# EAGLE design ESP32_breakout v2.1 (EAGLE 7.7.0)
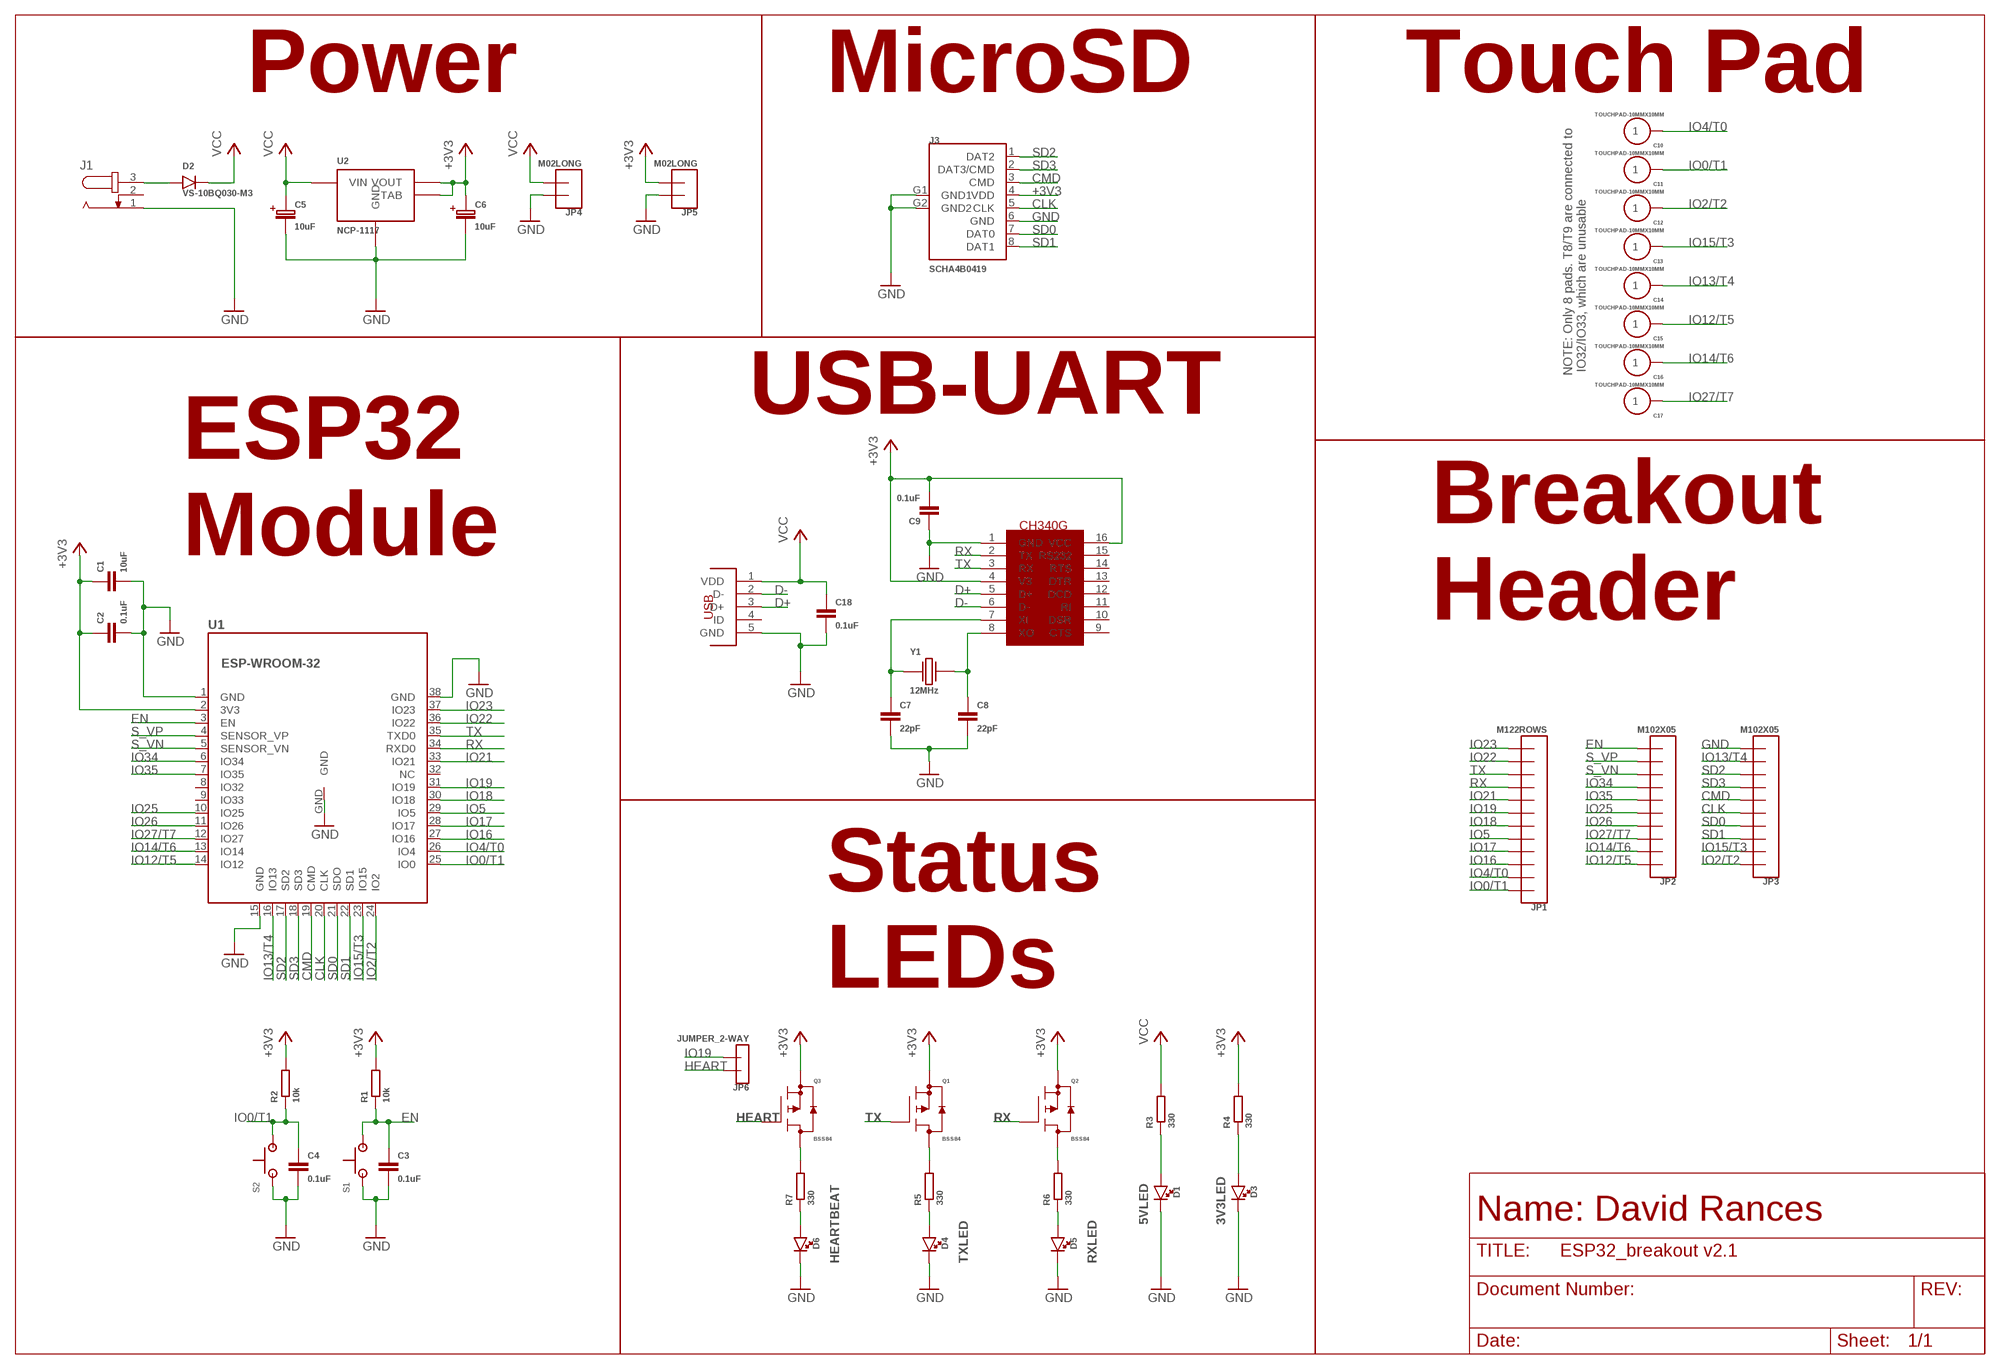
[diagram p0: schematic, sheet 1]

## Parts
C1  10uF  CAP0603  [CAP-0603]
C2  0.1uF  CAP0603  [CAP-0603]
C3  0.1uF  CAP0603  [CAP-0603]
C4  0.1uF  CAP0603  [CAP-0603]
C5  10uF  CAP-POLARCASEB-3528  [B-3528]
C6  10uF  CAP-POLARCASEB-3528  [B-3528]
C7  22pF  CAP0603  [CAP-0603]
C8  22pF  CAP0603  [CAP-0603]
C9  0.1uF  CAP0603  [CAP-0603]
C10  TOUCHPAD-10MMX10MM  [TOUCH-10MMX10MM]
C11  TOUCHPAD-10MMX10MM  [TOUCH-10MMX10MM]
C12  TOUCHPAD-10MMX10MM  [TOUCH-10MMX10MM]
C13  TOUCHPAD-10MMX10MM  [TOUCH-10MMX10MM]
C14  TOUCHPAD-10MMX10MM  [TOUCH-10MMX10MM]
C15  TOUCHPAD-10MMX10MM  [TOUCH-10MMX10MM]
C16  TOUCHPAD-10MMX10MM  [TOUCH-10MMX10MM]
C17  TOUCHPAD-10MMX10MM  [TOUCH-10MMX10MM]
C18  0.1uF  CAP0603  [CAP-0603]
D1  LED1206  [LED-1206]
D2  VS-10BQ030-M3  [DO-214AA]
D3  LED1206  [LED-1206]
D4  LED1206  [LED-1206]
D5  LED1206  [LED-1206]
D6  LED1206  [LED-1206]
J1  JACK-PLUG0  [SPC4077]
J3  SCHA4B0419  [MICROSD_SCHA4B0419]
JP1  M122ROWS  [2X06]
JP2  M102X05  [2X05]
JP3  M102X05  [2X05]
JP4  M02LONG  [1X02-LONG]
JP5  M02LONG  [1X02-LONG]
JP6  JUMPER_2-WAY  [1X02]
Q1  BSS84  [SOT-23-3]
Q2  BSS84  [SOT-23-3]
Q3  BSS84  [SOT-23-3]
R1  10k  RESISTOR0603  [RES-0603]
R2  10k  RESISTOR0603  [RES-0603]
R3  330  RESISTOR0805  [RES-0805]
R4  330  RESISTOR0805  [RES-0805]
R5  330  RESISTOR0805  [RES-0805]
R6  330  RESISTOR0805  [RES-0805]
R7  330  RESISTOR0805  [RES-0805]
S1  PUSHBUTTONSKHMQME010  [SKHMQME010]
S2  PUSHBUTTONSKHMQME010  [SKHMQME010]
U1  ESP-WROOM-32  [ESP-WROOM-32]
U2  NCP-1117  [SOT-223-4]
U$4  MOLEX_USBMICRO  [MOLEX_47346-001]
U$7  CH340G  [SOIC16]
Y1  12MHz  ABLS-12MHZ-B2-T  [HC-49/US]

## Nets
+3V3: C1.1 C2.1 C6.P C9.2 J3.4(VDD) JP5.2 Q1.S Q2.S Q3.S R1.2 R2.2 R4.2 U1.2(3V3) U2.2(VOUT) U2.PAD(TAB) U$7.4(V3) U$7.16(VCC)
CLK: J3.5(CLK) JP3.5 U1.20(CLK)
CMD: J3.3(CMD) JP3.6 U1.19(CMD)
D+: U$4.3(D+) U$7.5(D+)
D-: U$4.2(D-) U$7.6(D-)
EN: C3.1 JP2.10 R1.1 S1.3 S1.4 U1.3(EN)
GND: C1.2 C2.2 C3.2 C4.2 C5.N C6.N C7.2 C8.2 C9.1 C18.2 D1.C D3.C D4.C D5.C D6.C J1.1 J3.6(GND) J3.G1(GND1) J3.G2(GND2) JP3.10 JP4.1 JP5.1 S1.1 S1.2 S2.1 S2.2 U1.1(GND) U1.15(GND) U1.38(GND) U1.GND U2.1(GND) U$4.5(GND) U$7.1(GND)
HEART: JP6.1 Q3.G
IO0/T1: C4.1 C11.P$1 JP1.1 R2.1 S2.3 S2.4 U1.25(IO0)
IO2/T2: C12.P$1 JP3.1 U1.24(IO2)
IO4/T0: C10.P$1 JP1.2 U1.26(IO4)
IO5: JP1.5 U1.29(IO5)
IO12/T5: C15.P$1 JP2.1 U1.14(IO12)
IO13/T4: C14.P$1 JP3.9 U1.16(IO13)
IO14/T6: C16.P$1 JP2.2 U1.13(IO14)
IO15/T3: C13.P$1 JP3.2 U1.23(IO15)
IO16: JP1.3 U1.27(IO16)
IO17: JP1.4 U1.28(IO17)
IO18: JP1.6 U1.30(IO18)
IO19: JP1.7 JP6.2 U1.31(IO19)
IO21: JP1.8 U1.33(IO21)
IO22: JP1.11 U1.36(IO22)
IO23: JP1.12 U1.37(IO23)
IO25: JP2.5 U1.10(IO25)
IO26: JP2.4 U1.11(IO26)
IO27/T7: C17.P$1 JP2.3 U1.12(IO27)
IO34: JP2.7 U1.6(IO34)
IO35: JP2.6 U1.7(IO35)
N$1: D1.A R3.1
N$2: D2.A J1.3
N$3: C7.1 U$7.7(XI) Y1.P$1
N$4: C8.1 U$7.8(XO) Y1.P$2
N$5: D3.A R4.1
N$6: Q1.D R5.2
N$7: Q2.D R6.2
N$8: D4.A R5.1
N$9: D6.A R7.1
N$10: Q3.D R7.2
N$11: D5.A R6.1
RX: JP1.9 Q2.G U1.34(RXD0) U$7.2(TX)
S_VN: JP2.8 U1.5(SENSOR_VN)
S_VP: JP2.9 U1.4(SENSOR_VP)
SD0: J3.7(DAT0) JP3.4 U1.21(SDO)
SD1: J3.8(DAT1) JP3.3 U1.22(SD1)
SD2: J3.1(DAT2) JP3.8 U1.17(SD2)
SD3: J3.2(DAT3/CMD) JP3.7 U1.18(SD3)
TX: JP1.10 Q1.G U1.35(TXD0) U$7.3(RX)
VCC: C5.P C18.1 D2.C JP4.2 R3.2 U2.3(VIN) U$4.1(VDD)
Unconnected: J1.2 S1.5 S2.5 U1.8(IO32) U1.9(IO33) U1.32(NC) U$4.4(ID) U$7.9(CTS) U$7.10(DSR) U$7.11(RI) U$7.12(DCD) U$7.13(DTR) U$7.14(RTS) U$7.15(RS232)

## Notes on the sheet
- Power | MicroSD | Touch Pad
- NOTE: Only 8 pads. T8/T9 are connected to
   IO32/IO33, which are unusable
- USB-UART
- ESP32
  Module
- Breakout
  Header
- Status
  LEDs
- Name: David Rances
- 5VLED | 3V3LED
- HEARTBEAT | TXLED | RXLED

## Library data of the parts
C1-C4 C7-C9 C18 = dr-library:CAP: Multilayer Ceramic Capacitor
C5 C6 = dr-library:CAP-POLAR
C10-C17 = dr-library:TOUCHPAD
D1 D3-D6 = dr-library:LED
D2 = dr-library:VS-10BQ030-M3: Vishay Semiconductors High Performance Schottky Rectifier 1.0A Mfg. No. VS-10BQ030-M3/5BT http://www.mouser.com/ds/2/427/vs-10bq030-m3-552919.pdf
J1 = EmbeddedAdventures 3:JACK-PLUG: DC POWER JACK Power Jack, DC, Right Angle, Through Hole, Rated 5A at 16VDC, PC Terminals Distributor: Farnell (www.Farnell.de) Drawing: 84N1161.pdf / 84N1162.pdf Manufacturer: SPC Technology (www.spctechnology.com) Type: SPC4077 / SPC 4078
J3 = dr-library:SCHA4B0419: ALPS MicroSD Connector Manufacturer No. SCHA4B0419 http://www2.mouser.com/ProductDetail/ALPS/SCHA4B0419/?qs=sGAEpiMZZMuJakaoiLiBpsFSICW6cUCj0ci6XSEAGXcTwv1T7afZMw%3d%3d
JP1 = dr-library:M12
JP2 JP3 = dr-library:M10
JP4 JP5 = dr-library:M02
JP6 = dr-library:JUMPER_2-WAY
Q1-Q3 = dr-library:BSS84: Fairchild Semiconductor P-Channel Enhancement Mode MOSFET Mfg. No. BSS84 Mouser No. 512-BSS84 http://www.mouser.com/ds/2/149/BSS84-1006729.pdf
R1-R7 = dr-library:RESISTOR
S1 S2 = dr-library:PUSHBUTTON: ALPS Tactile Switch 50mA at 12V Mouser Product # 688-SKHMQME010
U1 = dr-library:ESP-WROOM-32
U2 = dr-library:NCP-1117: ON Semiconductor Low Dropout Positive Voltage Regulator 1A output Datasheet: http://www.mouser.com/ds/2/308/NCP1117LP-D-82673.pdf
U$4 = dr-library:MOLEX_USBMICRO
U$7 = usb-serial:CH340G
Y1 = dr-library:ABLS-12MHZ-B2-T: Abracon 12MHz Crystal 20ppm 18pF Load Cap Manufacturer Part No. - ABLS-12.000MHZ-B2-T

## Board
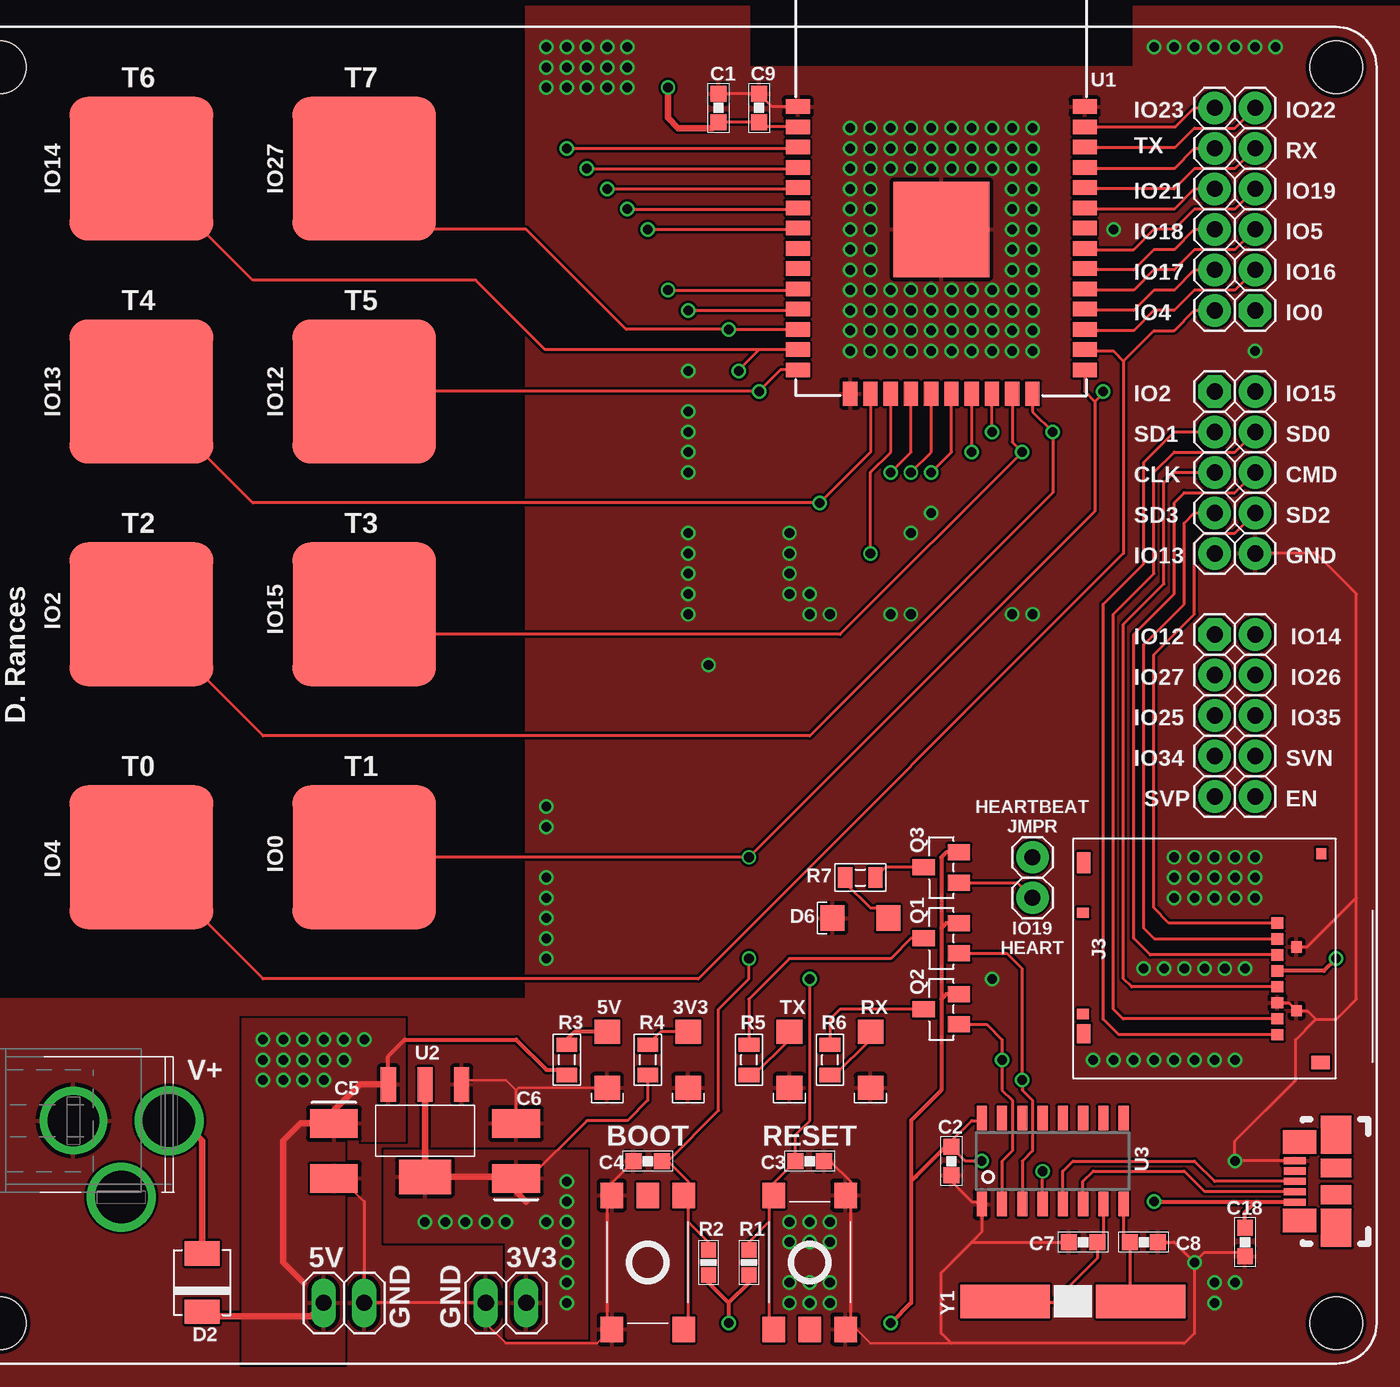
[diagram p1: board, top side]
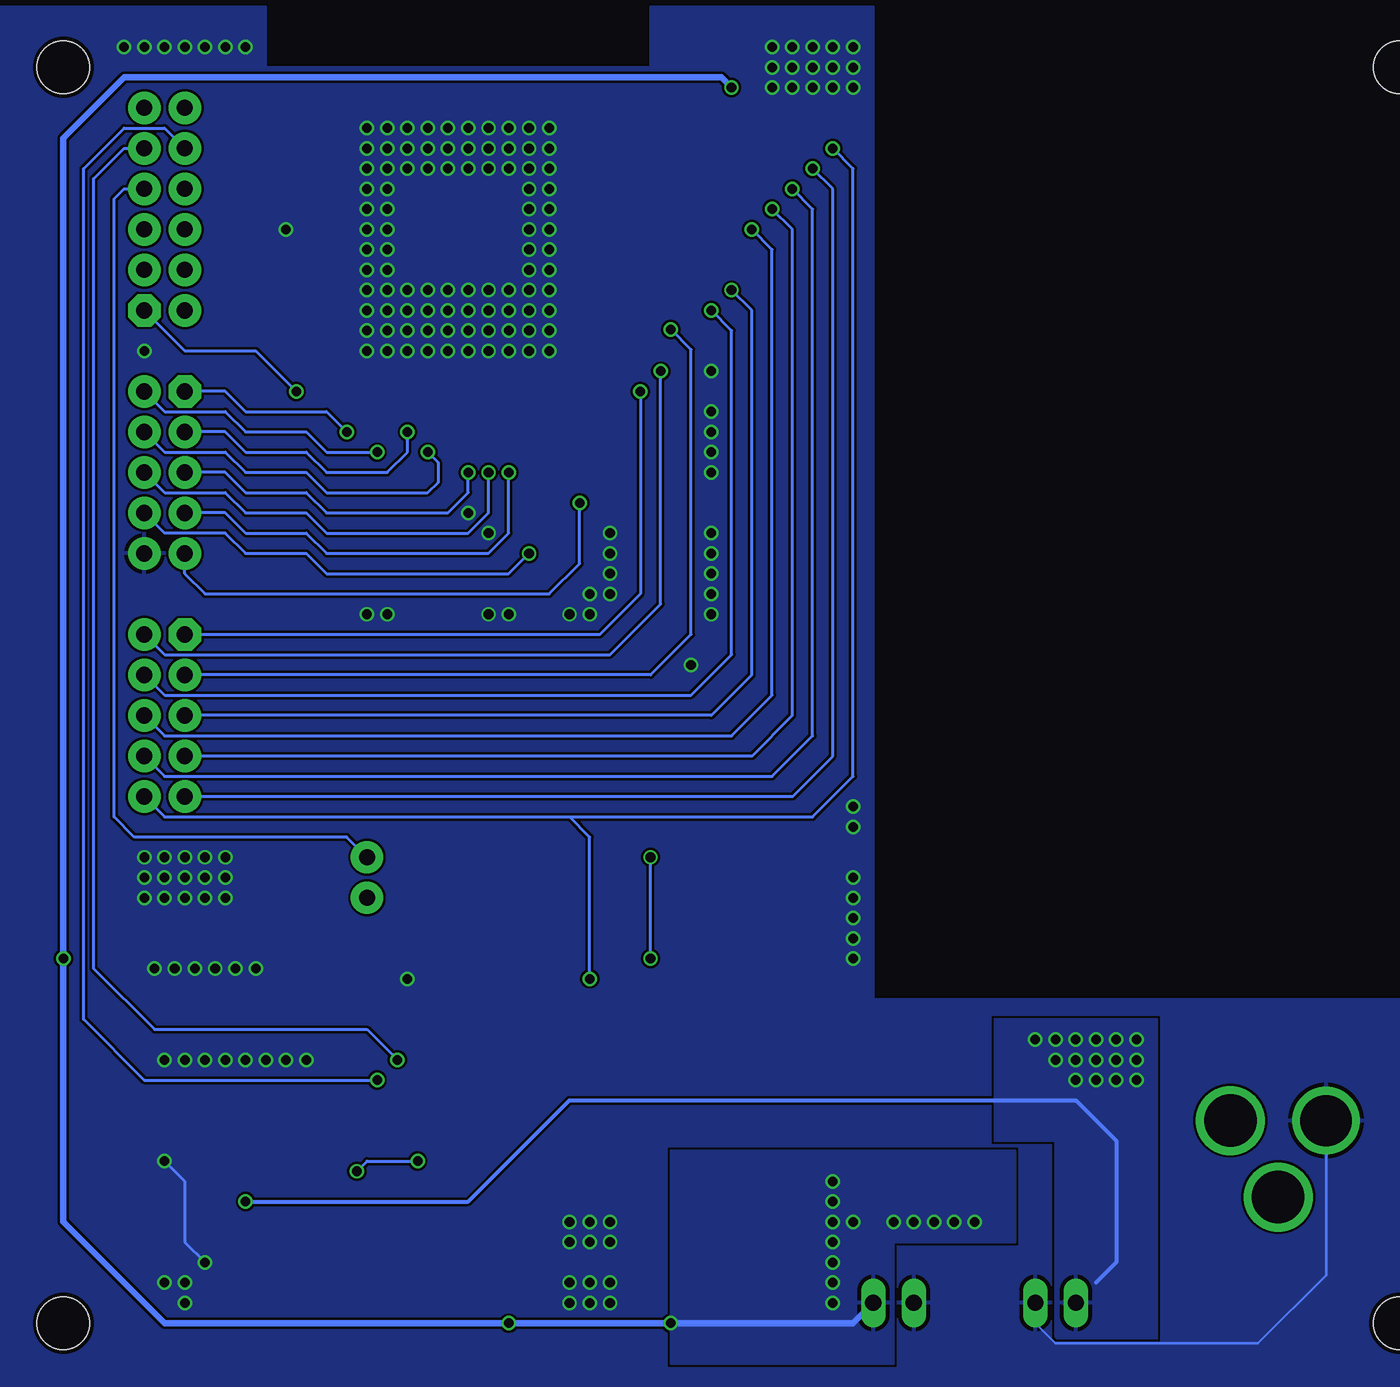
[diagram p2: board, bottom side, seen from below]

No outline drawn. Coordinates in mm, seen from the top.
Copper layers (1*16): Top 0.035mm / dielectric 1.5mm / Bottom 0.035mm
Design rules "SeeedStudio_2layer_DRU_no_angle_20140221": minimum track width 6mil, minimum drill 12mil, track to track 6mil, track to pad 6mil, pad to pad 6mil, via to via 6mil, smd to smd 0mil, copper to edge 10mil, drill to drill 10mil, minimum pad ring 10mil, minimum via ring 6mil, stop-mask expansion 2mil, vias tented up to drill 100mil, thermal gap 10mil

### Footprints (pad centres in the part's own frame; a part is rotated, then mirrored left to right if it is on the bottom)
CAP-0603 = smd 1 x 1: 1 -0.889,0; 2 0.889,0
B-3528 = smd 1.8 x 3: N 1.725,0; P -1.725,0
TOUCH-10MMX10MM = smd 9 x 9: P$1 0,0
LED-1206 = smd 1.5 x 1.6: A -1.75,0; C 1.75,0
DO-214AA = smd 1.52 x 2.18: A 1.83,0; C -1.83,0
SPC4077 = drill 3.2: 1 -3,0 | drill 3.3: 2 0,-4.8; 3 3,0
MICROSD_SCHA4B0419 = smd 0.7 x 0.75: 1 2.225,-12.825; 2 1.225,-12.825; 3 0.225,-12.825; 4 -0.775,-12.825; 5 -1.775,-12.825; 6 -2.775,-12.825; 7 -3.775,-12.825; 8 -4.775,-12.825 | smd 0.7 x 0.65: G1 -3.275,-14.025; G2 0.725,-14.025; P$1 6.575,-15.575 | smd 0.855 x 1.15: P$2 -6.515,-15.525 | smd 1.2 x 0.85: P$3 -4.713,-0.675 | smd 0.65 x 0.75: P$4 -3.475,-0.625; P$5 2.875,-0.625 | smd 1.3 x 0.85: P$6 6.013,-0.675
2X06 = drill 1.016 pad 2.032 octagon: 1 -1.27,-2.54 | drill 1.016 pad 2.032: 2 -1.27,0; 3 1.27,-2.54; 4 1.27,0; 5 3.81,-2.54; 6 3.81,0; 7 6.35,-2.54; 8 6.35,0; 9 8.89,-2.54; 10 8.89,0; 11 11.43,-2.54; 12 11.43,0
2X05 = drill 1.016 pad 2.032 octagon: 1 -1.27,-2.54 | drill 1.016 pad 2.032: 2 -1.27,0; 3 1.27,-2.54; 4 1.27,0; 5 3.81,-2.54; 6 3.81,0; 7 6.35,-2.54; 8 6.35,0; 9 8.89,-2.54; 10 8.89,0
1X02-LONG = drill 1.016 long: 1 -1.27,0; 2 1.27,0
1X02 = drill 1.016 pad 2.032: 1 -1.27,0; 2 1.27,0
SOT-23-3 = smd 1 x 1.4: D 0,1.1; G -0.95,-1.1; S 0.95,-1.1
RES-0603 = smd 0.965 x 0.965: 1 -0.787,0; 2 0.787,0
RES-0805 = smd 0.9 x 1.3: 1 -0.95,0; 2 0.95,0
SKHMQME010 = smd 1.6 x 1.4: 1 -4.2,2.25; 2 4.2,2.25; 3 -4.2,-2.25; 4 4.2,-2.25; 5 4.2,0
ESP-WROOM-32 = smd 0.9 x 1.5: 1 7.7,9; 2 6.43,9; 3 5.16,9; 4 3.89,9; 5 2.62,9; 6 1.35,9; 7 0.08,9; 8 -1.19,9; 9 -2.46,9; 10 -3.73,9; 11 -5,9; 12 -6.27,9; 13 -7.54,9; 14 -8.81,9; 25 -8.81,-9; 26 -7.54,-9; 27 -6.27,-9; 28 -5,-9; 29 -3.73,-9; 30 -2.46,-9; 31 -1.19,-9; 32 0.08,-9; 33 1.35,-9; 34 2.62,-9; 35 3.89,-9; 36 5.16,-9; 37 6.43,-9; 38 7.7,-9 | smd 1.5 x 0.9: 15 -10.3,5.715; 16 -10.3,4.445; 17 -10.3,3.175; 18 -10.3,1.905; 19 -10.3,0.635; 20 -10.3,-0.635; 21 -10.3,-1.905; 22 -10.3,-3.175; 23 -10.3,-4.445; 24 -10.3,-5.715 | smd 6 x 6: GND 0,0
SOT-223-4 = smd 0.95 x 2.15: 1 -2.3,-2.9; 2 0,-2.9; 3 2.3,-2.9 | smd 3.25 x 2.15: PAD 0,2.9
STAND-OFF-HOLE = hole 3.3: 0,0
MOLEX_47346-001 = smd 1.38 x 0.45: 1 2.61,1.3; 2 2.61,0.65; 3 2.61,0; 4 2.61,-0.65; 5 2.61,-1.3 | smd 2.1 x 1.475: P$1 2.3,2.462; P$2 2.3,-2.462 | smd 1.9 x 1.175: P$3 0,0.838; P$4 0,-0.838 | smd 1.9 x 2.375: P$5 0,2.913; P$6 0,-2.913
SOIC16 = smd 0.635 x 1.524: 1 -4.445,-2.695; 2 -3.175,-2.695; 3 -1.905,-2.695; 4 -0.635,-2.695; 5 0.635,-2.695; 6 1.905,-2.695; 7 3.175,-2.695; 8 4.445,-2.695; 9 4.445,2.695; 10 3.175,2.695; 11 1.905,2.695; 12 0.635,2.695; 13 -0.635,2.695; 14 -1.905,2.695; 15 -3.175,2.695; 16 -4.445,2.695
HC-49/US = smd 5.6 x 2.1: P$1 -4.25,0.1; P$2 4.25,0.1

### Placement (x,y rotation side)
C1  47.62,78.74 90 top
C2  62.23,12.7 270 top
C3  53.34,12.7 0 top
C4  43.18,12.7 180 top
C5  23.5,13.34 270 top
C6  34.92,13.34 90 top
C7  70.48,7.62 180 top
C8  74.3,7.62 0 top
C9  50.16,78.74 270 top
C10  11.43,31.75 0 top
C11  25.4,31.75 0 top
C12  11.43,46.99 0 top
C13  25.4,46.99 0 top
C14  11.43,60.96 0 top
C15  25.4,60.96 0 top
C16  11.43,74.93 180 top
C17  25.4,74.93 180 top
C18  80.64,7.62 270 top
D1  40.64,19.05 270 top
D2  15.24,5.08 90 top
D3  45.72,19.05 270 top
D4  52.07,19.05 270 top
D5  57.15,19.05 270 top
D6  56.52,27.94 180 top
J1  10.16,15.24 0 top
J3  69.85,25.4 90 top
JP1  78.74,67.31 90 top
JP2  81.28,44.45 270 top
JP3  81.28,59.69 270 top
JP4  24.13,3.81 180 top
JP5  34.29,3.81 0 top
JP6  67.31,30.48 90 top
Q1  61.59,26.67 90 top
Q2  61.59,22.23 90 top
Q3  61.59,31.11 90 top
R1  49.53,6.35 270 top
R2  46.99,6.35 270 top
R3  38.1,19.05 270 top
R4  43.18,19.05 270 top
R5  49.53,19.05 90 top
R6  54.61,19.05 90 top
R7  56.52,30.48 0 top
S1  53.34,6.35 270 top
S2  43.18,6.35 90 top
U1  61.59,71.12 90 top
U2  29.21,14.61 180 top
U$2  [STAND-OFF-HOLE]  86.36,2.54 0 top
U$4  86.36,11.43 180 top
U$6  [STAND-OFF-HOLE]  2.54,2.54 0 top
U$7  68.58,12.7 0 top
U$10  [STAND-OFF-HOLE]  86.36,81.28 0 top
U$11  [STAND-OFF-HOLE]  2.54,81.28 0 top
Y1  69.85,3.81 0 top

### Tracks (layer width: path | path; a pad name or v marks a point on that pad's centre or on a via)
+3V3  (via drill 0.6)
  Top 0.203: U1.2 50.47,77.55 C9.2 C1.1 | 62.23,13.97 63.5,15.24 63.98,15.24 U$7.16 | R4.2 43.18,16.51 41.91,15.24 39.37,15.24 35.56,11.43 35.1,11.43 C6.P | U$7.4 v67.94,12.06 | v64.14,12.7 63.12,12.7 C2.1 | 60.33,12.06 60.01,11.75
  Top 0.254: v86.36,25.4 85.58,24.62 J3.4 | 59.69,11.43 60.01,11.75 61.85,13.59 C2.1 62.23,13.97 | 59.69,11.43 59.69,3.81 v58.42,2.54 | R2.2 46.99,5.08 48.26,3.81 | 48.26,3.81 v48.26,2.54 | R1.2 49.53,5.08 48.26,3.81 | Q1.S 61.91,27.62 61.59,27.3 | 61.59,27.3 61.59,22.86 | Q2.S 61.91,23.18 61.59,22.86 | 61.59,22.86 61.59,17.14 59.69,15.24 59.69,11.43 | Q3.S 61.91,32.06 61.59,31.75 61.59,27.3
  Top 0.406: U2.2 U2.PAD 34.83,11.71 C6.P 34.92,10.79 35.56,10.16 | v44.45,80.01 44.45,78.11 45.09,77.47 47.24,77.47 C1.1
  Bottom 0.203: v67.94,12.06 67.31,12.7 v64.14,12.7
  Bottom 0.406: v44.45,80.01 45.09,80.64 82.55,80.64 86.36,76.83 v86.36,25.4 86.36,8.89 80.01,2.54 v58.42,2.54 v48.26,2.54 36.83,2.54 JP5.2
  other vias: 29.21,8.89 30.48,8.89 31.75,8.89 33.02,8.89 34.29,8.89 38.1,7.62 38.1,8.89 36.83,8.89 38.1,10.16 38.1,11.43 38.1,6.35 38.1,5.08 38.1,3.81
  pour Top: 26.67,13.34 26.67,7.62 34.29,7.62 34.29,0 39.37,0 39.37,13.34
  pour Bottom: 26.67,13.34 26.67,7.62 34.29,7.62 34.29,0 48.26,0 48.26,13.34
CLK  (via drill 0.6)
  Top 0.203: v60.96,55.88 62.23,57.15 U1.20 | J3.5 73.53,23.62 73.03,24.13 73.03,46.35 75.56,48.9 75.56,55.24 76.2,55.88 JP3.5
  Bottom 0.203: v60.96,55.88 60.96,54.61 62.23,53.34 69.85,53.34 71.12,54.61 74.93,54.61 76.2,55.88 JP3.5
CMD  (via drill 0.6)
  Top 0.203: v59.69,55.88 60.96,57.15 U1.19 | J3.3 74.7,25.62 73.66,26.67 73.66,45.72 76.2,48.26 76.2,53.98 76.83,54.61 80.01,54.61 JP3.6
  Bottom 0.203: v59.69,55.88 59.69,53.34 60.96,52.07 69.85,52.07 71.12,53.34 74.93,53.34 76.2,54.61 80.01,54.61 JP3.6
D+
  Top 0.203: U$7.5 69.22,12.06 69.85,12.7 77.47,12.7 78.74,11.43 U$4.3
D-
  Top 0.203: U$7.6 70.48,11.43 71.12,12.06 76.83,12.06 78.11,10.79 83.73,10.79 U$4.2
EN  (via drill 0.6)
  Top 0.203: v38.1,76.2 52.52,76.2 U1.3 | 50.8,8.89 50.8,10.16 51.09,10.45 S1.3 51.09,11.34 C3.1 52.45,14.35 53.34,15.24 v53.34,24.13 | 50.8,8.89 50.8,2.44 S1.4 | R1.1 49.53,7.62 50.8,8.89
  Bottom 0.203: 54.61,34.29 80.01,34.29 JP2.10 | 54.61,34.29 39.37,34.29 36.83,36.83 36.83,74.93 v38.1,76.2 | v53.34,24.13 53.34,33.02 54.61,34.29
GND  (via drill 0.6)
  Top 0.152: C6.N 34.92,17.14 | 34.92,17.14 34.29,17.78 31.75,17.78 31.75,17.75 U2.1 | D1.C 35.08,17.3 34.92,17.14 | 55.88,2.44 55.98,2.44 57.15,1.27 62.23,1.27 | 40.64,2.44 40.64,1.91 40.01,1.27 34.29,1.27 33.02,2.54 | C5.N 23.95,11.61 25.4,10.16 | 80.04,12.73 v80.01,12.7
  Top 0.203: U1.1 50.97,78.82 C9.1 C1.2 | S2.1 40.64,2.44 40.64,10.55 S2.2 40.93,11.34 C4.2 | S1.2 55.88,2.44 55.88,10.16 55.59,10.45 S1.1 55.88,10.84 55.88,11.43 54.61,12.7 C3.2 | C8.2 76.2,7.62 v77.47,6.35 | 63.5,7.62 61.59,5.71 61.59,1.91 62.23,1.27 76.83,1.27 77.47,1.91 v77.47,6.35 | 63.5,7.62 C7.2 | 63.5,7.62 64.14,8.26 U$7.1 63.98,10.16 63.5,10.16 62.23,11.43 C2.2 | U$4.5 80.04,12.73 | v77.47,6.35 78.11,6.99 80.39,6.99 | v80.01,12.7 80.01,13.97 83.82,17.78 83.82,20.32 85.09,21.59 | 85.09,21.59 86.36,21.59 87.63,22.86 87.63,29.21 | 87.63,29.21 87.63,48.26 85.09,50.8 JP3.10 | J3.6 83.38,22.62 J3.G1 84.56,22.12 85.09,21.59 | J3.G2 84.55,26.12 87.63,29.21 | 25.4,10.16 JP4.1 JP5.1 33.02,2.54
  Top 0.254: 80.39,6.99 C18.2
  Bottom 0.152: J1.1 7.16,5.54 11.43,1.27 24.13,1.27 25.4,2.54
  Bottom 0.203: v80.01,12.7 78.74,11.43 78.74,7.62 v77.47,6.35
  other vias: 57.15,67.31 57.15,66.04 58.42,66.04 58.42,67.31 59.69,67.31 60.96,67.31 62.23,67.31 63.5,67.31 64.77,67.31 66.04,67.31 66.04,66.04 64.77,66.04 63.5,66.04 62.23,66.04 60.96,66.04 59.69,66.04 57.15,64.77 58.42,64.77 59.69,64.77 60.96,64.77 62.23,64.77 63.5,64.77 64.77,64.77 66.04,64.77 67.31,64.77 67.31,66.04 67.31,67.31 55.88,64.77 55.88,66.04 55.88,67.31 55.88,63.5 57.15,63.5 58.42,63.5 59.69,63.5 60.96,63.5 62.23,63.5 63.5,63.5 64.77,63.5 66.04,63.5 67.31,63.5 66.04,68.58 66.04,69.85 66.04,72.39 66.04,71.12 66.04,73.66 66.04,74.93 67.31,68.58 67.31,69.85 67.31,71.12 67.31,72.39 67.31,73.66 67.31,74.93 57.15,68.58 57.15,69.85 57.15,71.12 57.15,72.39 57.15,73.66 57.15,74.93 57.15,76.2 55.88,68.58 55.88,69.85 55.88,71.12 55.88,72.39 55.88,73.66 55.88,74.93 55.88,76.2 58.42,74.93 59.69,74.93 60.96,74.93 62.23,74.93 63.5,74.93 64.77,74.93 66.04,76.2 67.31,76.2 64.77,76.2 63.5,76.2 62.23,76.2 60.96,76.2 59.69,76.2 58.42,76.2 55.88,77.47 57.15,77.47 58.42,77.47 59.69,77.47 60.96,77.47 62.23,77.47 63.5,77.47 64.77,77.47 66.04,77.47 67.31,77.47 41.91,80.01 40.64,80.01 39.37,80.01 38.1,80.01 36.83,80.01 36.83,81.28 36.83,82.55 38.1,82.55 38.1,81.28 39.37,81.28 39.37,82.55 40.64,82.55 40.64,81.28 41.91,81.28 41.91,82.55 74.93,82.55 76.2,82.55 77.47,82.55 78.74,82.55 80.01,82.55 81.28,82.55 82.55,82.55 52.07,8.89 53.34,8.89 54.61,8.89 54.61,7.62 53.34,7.62 52.07,7.62 52.07,5.08 52.07,3.81 53.34,3.81 53.34,5.08 54.61,5.08 54.61,3.81 45.72,59.69 45.72,58.42 45.72,57.15 45.72,55.88 45.72,62.23 45.72,52.07 45.72,50.8 45.72,49.53 45.72,48.26 45.72,46.99 52.07,52.07 52.07,50.8 52.07,49.53 52.07,48.26 53.34,48.26 53.34,46.99 54.61,46.99 58.42,46.99 46.99,43.81 59.69,52.07 60.96,53.34 36.83,34.92 36.83,33.66 36.83,30.48 36.83,29.21 36.83,27.94 36.83,26.67 36.83,25.4 71.12,19.05 72.39,19.05 73.66,19.05 74.93,19.05 76.2,19.05 77.47,19.05 78.74,19.05 80.01,19.05 81.28,31.75 80.01,31.75 78.74,31.75 77.47,31.75 76.2,31.75 76.2,30.48 77.47,30.48 78.74,30.48 80.01,30.48 81.28,30.48 81.28,29.21 80.01,29.21 78.74,29.21 77.47,29.21 76.2,29.21 66.04,46.99 67.31,46.99 59.69,46.99 81.28,63.5 75.56,24.77 76.83,24.77 78.11,24.77 79.38,24.77 80.64,24.77 74.3,24.77 72.39,71.12 78.74,5.08 80.01,5.08 78.74,3.81 64.77,24.13
  pour Bottom (rank 2): 35.56,83.82 35.56,22.86 -3.81,22.86 -3.81,-3.81 92.71,-3.81 92.71,85.09 73.66,85.09 73.66,81.28 49.53,81.28 49.53,85.09 35.56,85.09
  pour Top (rank 2): 49.53,85.09 35.56,85.09 35.56,22.86 -3.81,22.86 -3.81,-3.81 92.71,-3.81 92.71,85.09 73.66,85.09 73.66,81.28 49.53,81.28
HEART
  Top 0.203: Q3.G 66.36,30.16 JP6.1
IO0/T1  (via drill 0.6)
  Top 0.203: 71.23,60.33 71.23,53.45 v49.53,31.75 C11.P$1 | v71.75,60.96 71.86,60.96 71.23,60.33 | 45.72,8.89 45.72,10.16 45.43,10.45 S2.4 45.72,10.84 45.72,11.43 44.45,12.7 | 45.72,8.89 45.72,2.44 S2.3 | C4.1 44.45,12.7 | U1.25 70.59,60.96 71.23,60.33 | R2.1 46.99,7.62 45.72,8.89 | 44.45,12.7 47.62,15.88 47.62,22.23 49.53,24.13 v49.53,25.4
  Bottom 0.203: v71.75,60.96 74.3,63.5 78.74,63.5 JP1.1 | v49.53,25.4 v49.53,31.75
IO2/T2  (via drill 0.6)
  Top 0.203: C12.P$1 19.05,39.37 53.34,39.37 68.58,54.61 v68.58,58.42 67.31,59.69 U1.24
  Bottom 0.203: v68.58,58.42 69.85,59.69 74.93,59.69 76.2,60.96 JP3.1
IO4/T0
  Top 0.203: 73.03,62.87 73.03,50.8 46.35,24.13 19.05,24.13 C10.P$1 | 73.03,62.87 74.93,64.77 76.2,64.77 77.47,66.04 JP1.2 | U1.26 71.04,63.58 71.12,63.5 72.39,63.5 73.03,62.87
IO5
  Top 0.203: U1.29 71.31,67.31 73.66,67.31 74.93,68.58 76.2,68.58 77.47,69.85 80.01,69.85 JP1.5
IO12/T5  (via drill 0.6)
  Top 0.203: C15.P$1 v50.16,60.96 51.52,62.31 U1.14
  Bottom 0.203: v50.16,60.96 50.16,48.26 52.7,45.72 JP2.1
IO13/T4  (via drill 0.6)
  Top 0.203: U1.16 57.15,57.15 v53.98,53.98 18.41,53.98 C14.P$1
  Bottom 0.203: v53.98,53.98 53.98,50.16 55.88,48.26 77.47,48.26 78.74,49.53 JP3.9
IO14/T6  (via drill 0.6)
  Top 0.203: U1.13 50.16,63.58 | 50.16,63.58 36.75,63.58 32.38,67.94 18.41,67.94 C16.P$1 | v48.9,62.23 48.9,62.31 50.16,63.58
  Bottom 0.203: v48.9,62.23 48.9,47.62 52.07,44.45 80.01,44.45 JP2.2
IO15/T3  (via drill 0.6)
  Top 0.203: U1.23 66.04,57.78 v66.67,57.15 55.24,45.72 26.67,45.72 C13.P$1
  Bottom 0.203: v66.67,57.15 69.85,57.15 71.12,58.42 74.93,58.42 76.2,59.69 80.01,59.69 JP3.2
IO16
  Top 0.203: U1.27 71.31,64.77 73.66,64.77 74.93,66.04 76.2,66.04 77.47,67.31 80.01,67.31 JP1.3
IO17
  Top 0.203: U1.28 71.31,66.04 73.66,66.04 74.93,67.31 76.2,67.31 77.47,68.58 JP1.4
IO18
  Top 0.203: U1.30 71.31,68.58 73.66,68.58 74.93,69.85 76.2,69.85 77.47,71.12 JP1.6
IO19
  Top 0.203: U1.31 71.2,69.93 71.12,69.85 73.66,69.85 74.93,71.12 76.2,71.12 77.47,72.39 80.01,72.39 JP1.7
  Bottom 0.203: JP6.2 68.58,33.02 81.92,33.02 83.19,34.29 83.19,73.03 82.55,73.66 JP1.7
IO21
  Top 0.203: U1.33 71.31,72.39 76.2,72.39 77.47,73.66 JP1.8
IO22
  Top 0.203: U1.36 76.28,76.28 77.47,77.47 80.01,77.47 JP1.11
IO23
  Top 0.203: U1.37 76.28,77.55 77.47,78.74 JP1.12
IO25  (via drill 0.6)
  Top 0.203: v44.45,67.31 52.52,67.31 U1.10
  Bottom 0.203: v44.45,67.31 43.18,66.04 43.18,43.18 45.72,40.64 JP2.5
IO26  (via drill 0.6)
  Top 0.203: v45.72,66.04 52.52,66.04 U1.11
  Bottom 0.203: v45.72,66.04 44.45,64.77 44.45,44.45 46.99,41.91 80.01,41.91 JP2.4
IO27/T7  (via drill 0.6)
  Top 0.203: C17.P$1 29.21,71.12 35.56,71.12 41.83,64.85 v48.26,64.85 U1.12
  Bottom 0.203: v48.26,64.85 46.99,63.58 46.99,45.72 49.53,43.18 JP2.3
IO34  (via drill 0.6)
  Top 0.203: v41.91,72.39 52.52,72.39 U1.6
  Bottom 0.203: v41.91,72.39 40.64,71.12 40.64,40.64 43.18,38.1 JP2.7
IO35  (via drill 0.6)
  Top 0.203: v43.18,71.12 52.52,71.12 U1.7
  Bottom 0.203: v43.18,71.12 41.91,69.85 41.91,41.91 44.45,39.37 80.01,39.37 JP2.6
N$1
  Top 0.254: D1.A 38.58,20.8 38.1,20.32 R3.1
N$2
  Top 0.406: J1.3 13.97,15.24 15.24,13.97 D2.A
N$3
  Top 0.203: U$7.7 71.75,8 C7.1 71.37,6.6 68.58,3.81 65.7,3.81 Y1.P$1
N$4
  Top 0.203: U$7.8 73.03,8 C8.1 73.41,4.6 Y1.P$2
N$5
  Top 0.203: D3.A 43.98,20.8 R4.1
N$6
  Top 0.203: Q1.D 59.69,26.67 58.42,25.4 52.07,25.4 49.53,22.86 R5.2
N$7
  Top 0.203: Q2.D 55.24,22.23 54.61,21.59 R6.2
N$8
  Top 0.203: R5.1 49.85,18.1 52.07,20.32 D4.A
N$9
  Top 0.203: R7.1 55.56,30.16 57.15,28.57 57.63,28.57 D6.A
N$10
  Top 0.203: Q3.D 58.1,31.11 R7.2
N$11
  Top 0.203: R6.1 54.93,18.1 57.15,20.32 D5.A
RX  (via drill 0.6)
  Top 0.203: U1.34 71.31,73.66 76.2,73.66 77.47,74.93 80.01,74.93 JP1.9 | v65.41,19.05 65.41,18.41 | Q2.G 64.45,21.27 65.41,20.32 v65.41,19.05 | v65.41,19.05 65.41,17.14 66.04,16.51 66.04,13.34 65.41,12.7 U$7.2
  Bottom 0.203: v65.41,19.05 67.31,20.95 80.64,20.95 84.45,24.77 84.45,74.3 82.55,76.2 JP1.9
S_VN  (via drill 0.6)
  Top 0.203: v40.64,73.66 52.52,73.66 U1.5
  Bottom 0.203: v40.64,73.66 39.37,72.39 39.37,39.37 41.91,36.83 80.01,36.83 JP2.8
S_VP  (via drill 0.6)
  Top 0.203: v39.37,74.93 52.52,74.93 U1.4
  Bottom 0.203: v39.37,74.93 38.1,73.66 38.1,38.1 40.64,35.56 JP2.9
SD0  (via drill 0.6)
  Top 0.203: v63.5,57.15 U1.21 | J3.7 72.99,21.62 72.39,22.23 72.39,46.99 74.93,49.53 74.93,55.88 76.2,57.15 80.01,57.15 JP3.4
  Bottom 0.203: v63.5,57.15 62.87,56.52 62.87,55.24 63.5,54.61 69.85,54.61 71.12,55.88 74.93,55.88 76.2,57.15 80.01,57.15 JP3.4
SD1  (via drill 0.6)
  Top 0.203: v64.77,58.42 U1.22 | J3.8 72.72,20.62 71.75,21.59 71.75,47.62 74.3,50.16 74.3,56.52 76.2,58.42 JP3.3
  Bottom 0.203: v64.77,58.42 64.77,57.15 66.04,55.88 69.85,55.88 71.12,57.15 74.93,57.15 76.2,58.42 JP3.3
SD2  (via drill 0.6)
  Top 0.203: v57.15,50.8 57.15,55.88 58.42,57.15 U1.17 | J3.1 75.88,27.62 74.93,28.57 74.93,44.45 77.47,46.99 77.47,51.44 78.11,52.07 80.01,52.07 JP3.8
  Bottom 0.203: v57.15,50.8 58.42,49.53 69.85,49.53 71.12,50.8 74.93,50.8 76.2,52.07 80.01,52.07 JP3.8
SD3  (via drill 0.6)
  Top 0.203: v58.42,55.88 59.69,57.15 U1.18 | J3.2 74.97,26.62 74.3,27.3 74.3,45.09 76.83,47.62 76.83,52.7 77.47,53.34 JP3.7
  Bottom 0.203: v58.42,55.88 58.42,52.07 59.69,50.8 69.85,50.8 71.12,52.07 74.93,52.07 76.2,53.34 JP3.7
TX  (via drill 0.6)
  Top 0.203: U1.35 71.31,74.93 76.2,74.93 77.47,76.2 JP1.10 | Q1.G 65.72,25.72 66.67,24.77 v66.67,17.78 66.67,17.14 67.31,16.51 67.31,13.34 66.67,12.7 U$7.3
  Bottom 0.203: v66.67,17.78 81.28,17.78 85.09,21.59 85.09,74.93 82.55,77.47 80.01,77.47 JP1.10
VCC  (via drill 0.6)
  Top 0.254: U2.3 26.91,19.29 27.94,20.32 34.92,20.32 36.83,18.41 37.78,18.41 R3.2 | U$4.1 81.28,10.13 | 81.28,10.13 74.96,10.13 v74.93,10.16 | C18.1 80.64,9.49 81.28,10.13
  Top 0.406: JP4.2 22.03,2.98 15.51,2.98 D2.C | U2.3 25.12,17.5 23.5,15.88 C5.P 21.41,15.06 20.32,13.97 20.32,6.35 21.59,5.08
  Bottom 0.254: v74.93,10.16 60.96,10.16 54.61,16.51 22.86,16.51 20.32,13.97 20.32,6.35 21.59,5.08
  other vias: 25.4,20.32 24.13,20.32 22.86,20.32 21.59,20.32 20.32,20.32 19.05,20.32 24.13,19.05 22.86,19.05 21.59,19.05 20.32,19.05 19.05,19.05 22.86,17.78 21.59,17.78 20.32,17.78 19.05,17.78
  pour Top: 27.94,13.97 27.94,21.59 17.78,21.59 17.78,0 24.13,0 24.13,13.97
  pour Bottom: 17.78,21.59 17.78,0 24.13,0 24.13,13.97 27.94,13.97 27.94,21.59

### Text on the board
tPlace: T6 | T7 | IO23 | IO22 | TX | RX | IO14 | IO27 | IO21 | IO19 | IO18 | IO5 | IO17 | IO16 | T4 | T5 | IO4 | IO0 | IO2 | IO15 | IO13 | IO12 | SD1 | SD0 | CLK | CMD | SD3 | SD2 | T2 | T3 | IO13 | GND | IO2 | IO15 | IO12 | IO14 | ESP32 Breakout v2.0 / D. Rances | IO27 | IO26 | IO25 | IO35 | T0 | T1 | IO34 | SVN | SVP | EN | HEARTBEAT / JMPR | IO0 | IO4 | IO19 / HEART | 5V | 3V3 | TX | RX | V+ | BOOT | RESET | U3 | 5V | 3V3 | GND | GND
bStop: ESP32 Breakout / 13 June 2017 v2.0 / D. Rances